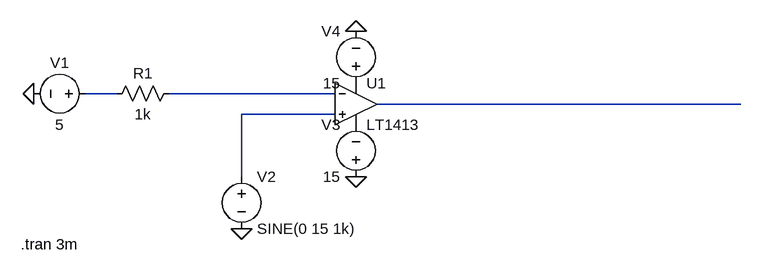
[diagram p0: schematic comparatornon-inv.asc]
comparatornon-inv.asc, the LTspice schematic file:
Version 4
SHEET 1 900 680
WIRE -64 112 -112 112
WIRE 272 112 16 112
WIRE 896 128 336 128
WIRE 272 144 128 144
WIRE 128 240 128 144
FLAG 304 240 0
FLAG 128 320 0
FLAG -192 112 0
FLAG 304 16 0
SYMBOL OpAmps\\LT1413 304 64 R0
SYMATTR InstName U1
SYMBOL res 32 96 R90
WINDOW 0 0 56 VBottom 2
WINDOW 3 32 56 VTop 2
SYMATTR InstName R1
SYMATTR Value 1k
SYMBOL voltage -96 112 R90
WINDOW 0 -32 56 VBottom 2
WINDOW 3 32 56 VTop 2
WINDOW 123 0 0 Left 0
WINDOW 39 0 0 Left 0
SYMATTR InstName V1
SYMATTR Value 5
SYMBOL voltage 128 224 R0
WINDOW 123 0 0 Left 0
WINDOW 39 0 0 Left 0
SYMATTR InstName V2
SYMATTR Value SINE(0 15 1k)
SYMBOL voltage 304 256 R180
WINDOW 0 24 96 Left 2
WINDOW 3 24 16 Left 2
WINDOW 123 0 0 Left 0
WINDOW 39 0 0 Left 0
SYMATTR InstName V3
SYMATTR Value 15
SYMBOL voltage 304 112 R180
WINDOW 0 24 96 Left 2
WINDOW 3 24 16 Left 2
WINDOW 123 0 0 Left 0
WINDOW 39 0 0 Left 0
SYMATTR InstName V4
SYMATTR Value 15
TEXT -212 344 Left 2 !.tran 3m

The netlist it stands for:
* comparatornon-inv.asc
XU1 N004 N002 P001 P002 N003 LT1413  ; pins In+ In- V+ V- OUT
R1 N002 N001 1k
V1 N001 0 5
V2 N004 0 SINE(0 15 1k)
V3 0 P002 15
V4 P001 0 15
.tran 3m
.lib LTC.lib
.backanno
.end